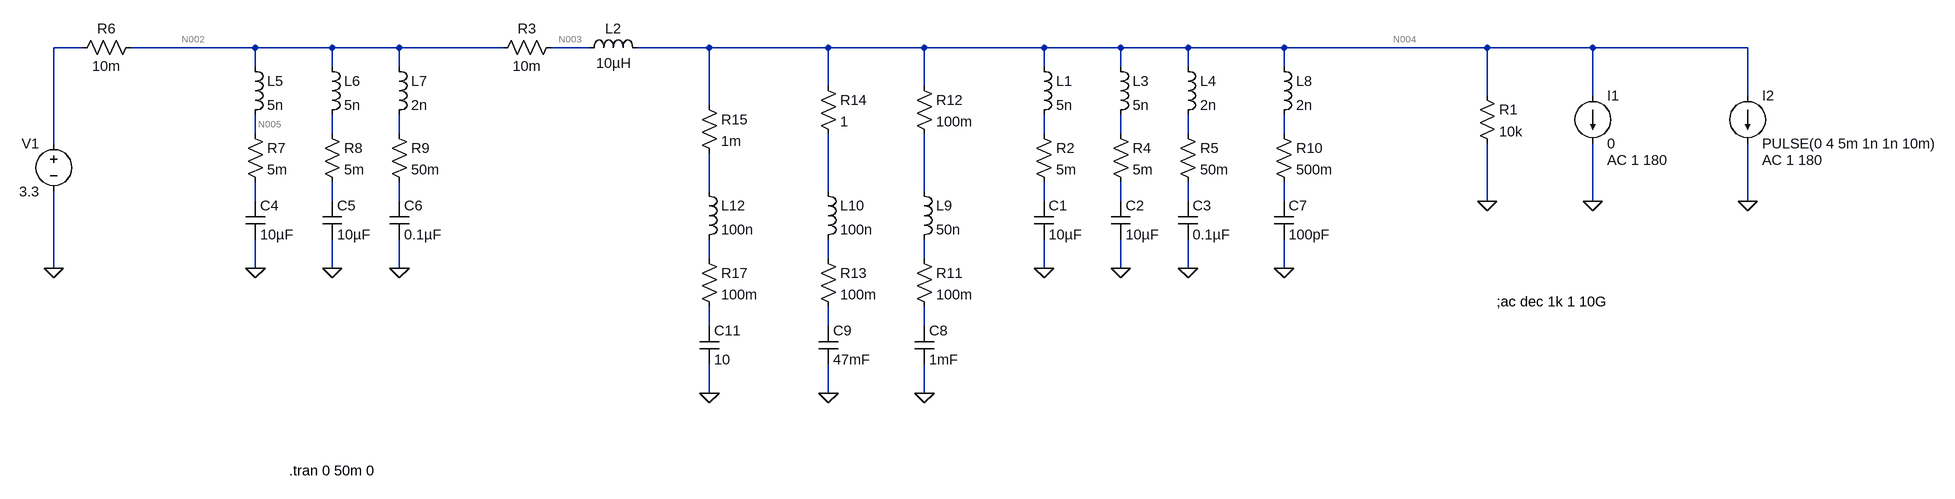
[diagram p0: schematic 3V3_Decoupling.asc]
3V3_Decoupling.asc, the LTspice schematic file:
Version 4
SHEET 1 1484 744
WIRE -2048 -16 -2096 -16
WIRE -1760 -16 -1968 -16
WIRE -1632 -16 -1760 -16
WIRE -1520 -16 -1632 -16
WIRE -1344 -16 -1520 -16
WIRE -1200 -16 -1264 -16
WIRE -960 -16 -1120 -16
WIRE -640 -16 -960 -16
WIRE -480 -16 -640 -16
WIRE -224 -16 -480 -16
WIRE -96 -16 -224 -16
WIRE 16 -16 -96 -16
WIRE 176 -16 16 -16
WIRE 688 -16 176 -16
WIRE 864 -16 688 -16
WIRE 1152 -16 864 -16
WIRE -1760 16 -1760 -16
WIRE -1632 16 -1632 -16
WIRE -1520 16 -1520 -16
WIRE -224 16 -224 -16
WIRE -96 16 -96 -16
WIRE 16 16 16 -16
WIRE 176 16 176 -16
WIRE -640 48 -640 -16
WIRE -480 48 -480 -16
WIRE 688 64 688 -16
WIRE 864 64 864 -16
WIRE 1152 64 1152 -16
WIRE -960 80 -960 -16
WIRE -1760 128 -1760 96
WIRE -1632 128 -1632 96
WIRE -1520 128 -1520 96
WIRE -224 128 -224 96
WIRE -96 128 -96 96
WIRE 16 128 16 96
WIRE 176 128 176 96
WIRE -2096 144 -2096 -16
WIRE -960 224 -960 160
WIRE -640 224 -640 128
WIRE -480 224 -480 128
WIRE -1760 240 -1760 208
WIRE -1632 240 -1632 208
WIRE -1520 240 -1520 208
WIRE -224 240 -224 208
WIRE -96 240 -96 208
WIRE 16 240 16 208
WIRE 176 240 176 208
WIRE 688 240 688 144
WIRE 864 240 864 144
WIRE 1152 240 1152 144
WIRE -960 336 -960 304
WIRE -640 336 -640 304
WIRE -480 336 -480 304
WIRE -2096 352 -2096 224
WIRE -1760 352 -1760 304
WIRE -1632 352 -1632 304
WIRE -1520 352 -1520 304
WIRE -224 352 -224 304
WIRE -96 352 -96 304
WIRE 16 352 16 304
WIRE 176 352 176 304
WIRE -960 448 -960 416
WIRE -640 448 -640 416
WIRE -480 448 -480 416
WIRE -960 560 -960 512
WIRE -640 560 -640 512
WIRE -480 560 -480 512
FLAG 688 240 0
FLAG 864 240 0
FLAG -2096 352 0
FLAG -224 352 0
FLAG -96 352 0
FLAG 16 352 0
FLAG -1760 352 0
FLAG -1632 352 0
FLAG -1520 352 0
FLAG 176 352 0
FLAG -480 560 0
FLAG -640 560 0
FLAG 1152 240 0
FLAG -960 560 0
SYMBOL current 864 64 R0
WINDOW 123 24 108 Left 2
WINDOW 39 0 0 Left 0
SYMATTR InstName I1
SYMATTR Value 0
SYMATTR Value2 AC 1 180
SYMBOL res 672 48 R0
SYMATTR InstName R1
SYMATTR Value 10k
SYMBOL ind -240 0 R0
SYMATTR InstName L1
SYMATTR Value 5n
SYMBOL res -240 112 R0
SYMATTR InstName R2
SYMATTR Value 5m
SYMBOL cap -240 240 R0
SYMATTR InstName C1
SYMATTR Value 10µF
SYMBOL ind -1216 0 R270
WINDOW 0 32 56 VTop 2
WINDOW 3 5 56 VBottom 2
SYMATTR InstName L2
SYMATTR Value 10µH
SYMBOL res -1248 -32 R90
WINDOW 0 0 56 VBottom 2
WINDOW 3 32 56 VTop 2
SYMATTR InstName R3
SYMATTR Value 10m
SYMBOL ind -112 0 R0
SYMATTR InstName L3
SYMATTR Value 5n
SYMBOL res -112 112 R0
SYMATTR InstName R4
SYMATTR Value 5m
SYMBOL cap -112 240 R0
SYMATTR InstName C2
SYMATTR Value 10µF
SYMBOL ind 0 0 R0
SYMATTR InstName L4
SYMATTR Value 2n
SYMBOL res 0 112 R0
SYMATTR InstName R5
SYMATTR Value 50m
SYMBOL cap 0 240 R0
SYMATTR InstName C3
SYMATTR Value 0.1µF
SYMBOL voltage -2096 128 M0
WINDOW 123 0 0 Left 0
WINDOW 39 0 0 Left 0
SYMATTR InstName V1
SYMATTR Value 3.3
SYMBOL res -1952 -32 R90
WINDOW 0 0 56 VBottom 2
WINDOW 3 32 56 VTop 2
SYMATTR InstName R6
SYMATTR Value 10m
SYMBOL ind -1776 0 R0
SYMATTR InstName L5
SYMATTR Value 5n
SYMBOL res -1776 112 R0
SYMATTR InstName R7
SYMATTR Value 5m
SYMBOL cap -1776 240 R0
SYMATTR InstName C4
SYMATTR Value 10µF
SYMBOL ind -1648 0 R0
SYMATTR InstName L6
SYMATTR Value 5n
SYMBOL res -1648 112 R0
SYMATTR InstName R8
SYMATTR Value 5m
SYMBOL cap -1648 240 R0
SYMATTR InstName C5
SYMATTR Value 10µF
SYMBOL ind -1536 0 R0
SYMATTR InstName L7
SYMATTR Value 2n
SYMBOL res -1536 112 R0
SYMATTR InstName R9
SYMATTR Value 50m
SYMBOL cap -1536 240 R0
SYMATTR InstName C6
SYMATTR Value 0.1µF
SYMBOL ind 160 0 R0
SYMATTR InstName L8
SYMATTR Value 2n
SYMBOL res 160 112 R0
SYMATTR InstName R10
SYMATTR Value 500m
SYMBOL cap 160 240 R0
SYMATTR InstName C7
SYMATTR Value 100pF
SYMBOL ind -496 208 R0
SYMATTR InstName L9
SYMATTR Value 50n
SYMBOL res -496 320 R0
SYMATTR InstName R11
SYMATTR Value 100m
SYMBOL cap -496 448 R0
SYMATTR InstName C8
SYMATTR Value 1mF
SYMBOL res -496 32 R0
SYMATTR InstName R12
SYMATTR Value 100m
SYMBOL ind -656 208 R0
SYMATTR InstName L10
SYMATTR Value 100n
SYMBOL res -656 320 R0
SYMATTR InstName R13
SYMATTR Value 100m
SYMBOL cap -656 448 R0
SYMATTR InstName C9
SYMATTR Value 47mF
SYMBOL res -656 32 R0
SYMATTR InstName R14
SYMATTR Value 1
SYMBOL current 1152 64 R0
WINDOW 123 24 108 Left 2
WINDOW 39 0 0 Left 0
SYMATTR InstName I2
SYMATTR Value PULSE(0 4 5m 1n 1n 10m)
SYMATTR Value2 AC 1 180
SYMBOL ind -976 208 R0
SYMATTR InstName L12
SYMATTR Value 100n
SYMBOL res -976 320 R0
SYMATTR InstName R17
SYMATTR Value 100m
SYMBOL cap -976 448 R0
SYMATTR InstName C11
SYMATTR Value 10
SYMBOL res -976 64 R0
SYMATTR InstName R15
SYMATTR Value 1m
TEXT 704 408 Left 2 !;ac dec 1k 1 10G
TEXT -1704 728 Left 2 !.tran 0 50m 0

The netlist it stands for:
* 3V3_Decoupling.asc
I1 N004 0 0 AC 1 180
R1 N004 0 10k
L1 N004 N008 5n
R2 N008 N018 5m
C1 N018 0 10µF
L2 N003 N004 10µH
R3 N003 N002 10m
L3 N004 N009 5n
R4 N009 N019 5m
C2 N019 0 10µF
L4 N004 N010 2n
R5 N010 N020 50m
C3 N020 0 0.1µF
V1 N001 0 3.3
R6 N002 N001 10m
L5 N002 N005 5n
R7 N005 N015 5m
C4 N015 0 10µF
L6 N002 N006 5n
R8 N006 N016 5m
C5 N016 0 10µF
L7 N002 N007 2n
R9 N007 N017 50m
C6 N017 0 0.1µF
L8 N004 N011 2n
R10 N011 N021 500m
C7 N021 0 100pF
L9 N014 N024 50n
R11 N024 N027 100m
C8 N027 0 1mF
R12 N004 N014 100m
L10 N013 N023 100n
R13 N023 N026 100m
C9 N026 0 47mF
R14 N004 N013 1
I2 N004 0 PULSE(0 4 5m 1n 1n 10m) AC 1 180
L12 N012 N022 100n
R17 N022 N025 100m
C11 N025 0 10
R15 N004 N012 1m
;ac dec 1k 1 10G
.tran 0 50m 0
.backanno
.end

* Results of the author's LTspice run, read from the files saved beside the schematic
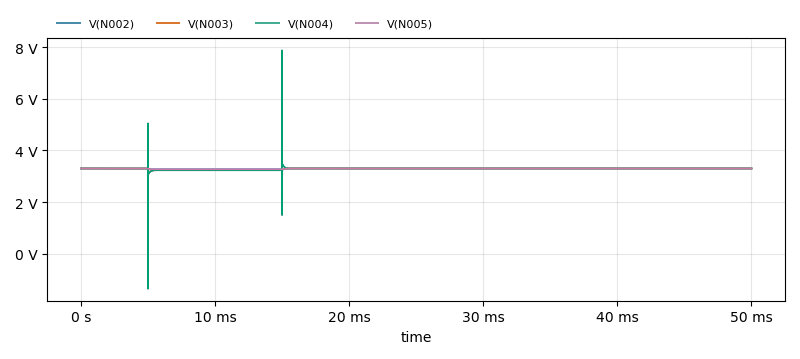
[diagram p1: Transient Analysis of 3V3_Decoupling.asc, plotted from the saved traces]
* Transient Analysis, 1 run:
*   V(N002): min 3.267 V, max 3.3 V, average 3.293 V, rms 3.293 V, last 3.3 V
*   V(N003): min 3.234 V, max 3.301 V, average 3.287 V, rms 3.287 V, last 3.3 V
*   V(N004): min -1.362 V, max 7.876 V, average 3.286 V, rms 3.286 V, last 3.3 V
*   V(N005): min 3.267 V, max 3.3 V, average 3.293 V, rms 3.293 V, last 3.3 V